# Altium project FMC-320U-A2.PrjPcb
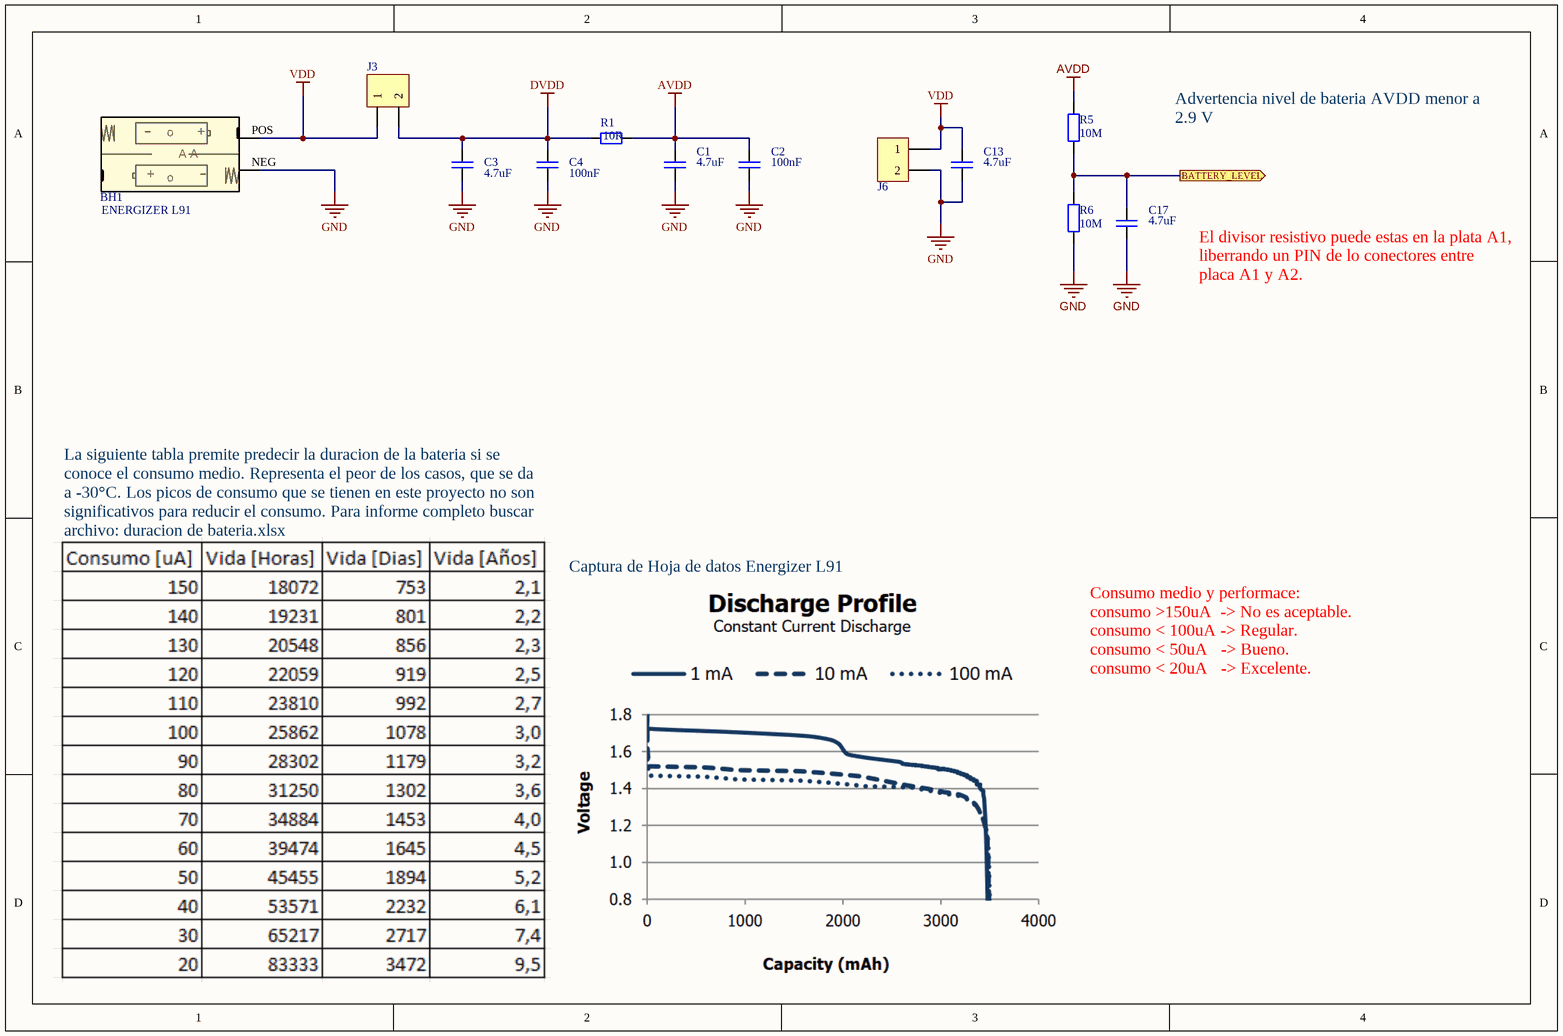
[diagram p0: BATTERY.SchDoc]
5 sheets, 67 parts. Net scope: flat (ports and power ports of the same name join across sheets).
Board file: FMC-320U-A2.PcbDoc
Sheets:
  BATTERY.SchDoc
  CON2.SchDoc
  DIO.SchDoc
  PULSE.SchDoc
  SENSOR.SchDoc

## Sheet BATTERY.SchDoc
size A4

### Parts
BH1  ENERGIZER L91  [BATTERY_HOLDER_2XAA]
C1  4.7uF  [CAP_SM0805_YAGEOCC2_N]
C2  100nF  [CAP_SM0805_YAGEOCC2_N]
C3  4.7uF  [CAP_SM0805_YAGEOCC2_N]
C4  100nF  [CAP_SM0805_YAGEOCC2_N]
C13  4.7uF  [CAP_SM0805_YAGEOCC2_N]
C17  4.7uF  [CAP_SM0805_YAGEOCC2_N]
J3  Usar Equivalente  [HEADER PIN 1X2]  (value not drawn)
J6  Usar Equivalente  [HEADER PIN 1X2]  (value not drawn)
R1  10R  [RES_SM0805_YAGEORC_N]
R5  10M  [RES_SM0805_YAGEORC_N]
R6  10M  [RES_SM0805_YAGEORC_N]

### Ports
BATTERY_LEVEL (out)

### Nets
AVDD: C1.1 C2.1 R1.2 R5.2
DVDD: C3.1 C4.1 J3.2 R1.1
GND: BH1.NEG C1.2 C2.2 C3.2 C4.2 C13.2 C17.2 J6.2 R6.1
VDD: BH1.POS C13.1 J3.1 J6.1
BATTERY_LEVEL: C17.1 R5.1 R6.2 ; port BATTERY_LEVEL

### Notes on the sheet
- Advertencia nivel de bateria AVDD menor a 2.9 V
- El divisor resistivo puede estas en la plata A1, liberrando un PIN de lo conectores entre  placa A1 y A2.
- La siguiente tabla premite predecir la duracion de la bateria si se conoce el consumo medio. Representa el peor de los casos, que se da a -30°C. Los picos de consumo que se tienen en este proyecto no son significativos para reducir el consumo. Para informe completo buscar archivo: duracion de bateria.xlsx
- Captura de Hoja de datos Energizer L91
- Consumo medio y performace:
  consumo >150uA  -> No es aceptable.
  consumo < 100uA -> Regular.
  consumo < 50uA   -> Bueno.
  consumo < 20uA   -> Excelente.
- Title:
- Size: A4
- Date:
- FMC-320U MODEL A
- Sheet:
- Time:
- Of:
- Version:
- Revision:
- Release:
- 1
- 0
- FLOWMEET SRL
- File
- (in symbol 2462) +; A A

### Library data of the parts
BH1 = 2462: 2 x AA through hole economic type; Manufacturer: Keystone; Manufacturer Part Number: 2462; Category: Battery holder; Datasheet: https://www.keyelco.com/userAssets/file/M65p28.pdf; Temperature Max: -; Temperature Min: -
C1 C3 C13 C17 = CC0805KRX5R6BB475: CAP 4.7uF SM0805 X5R 10V YAGEO CC2; Tolerance (%): 10; Category: Capacitor; Manufacturer: Yageo; Manufacturer Part Number: CC0805KRX5R6BB475; Package: 0805; Value: 4.7uF; Supplier Part Number 1: 718671; Supplier 1: Farnell; ComponentLink1URL: http://www.yageo.com; ComponentLink1Description: Manufacturer Website; Voltage Rating (Volts): 10; Supplier 2: Digi-Key; Supplier Part Number 2: 311-1374-1-ND; Datasheet: https://datasheet.lcsc.com/lcsc/2304140030_YAGEO-CC0805KRX5R6BB475_C605218.pdf
C2 C4 = CC0805KRX7R8BB104: CAP 100nF SM0805 X7R 25V YAGEO CC2; Tolerance (%): 10; Voltage Rating (Volts): 25; Category: Capacitor; Manufacturer: Yageo; Manufacturer Part Number: CC0805KRX7R8BB104; Package: 0805; Value: 100nF; Supplier Part Number 1: 644249; Supplier 1: Farnell; ComponentLink1URL: http://www.yageo.com; ComponentLink1Description: Manufacturer Website; Supplier 2: Digi-Key; Supplier Part Number 2: 311-1141-1-ND; Datasheet: https://datasheet.lcsc.com/lcsc/2006111832_YAGEO-CC0805KRX7R8BB104_C519981.pdf
J3 J6 = 54101-T0602LF: 1 x 2 - true hole  2.54mm - Pb free; Manufacturer: Amphenol ICC; Equivalente: B-2100S02P-A110; Manufacturer Part Number: 54101-T0602LF; Category: Header pin; Datasheet: https://datasheet.lcsc.com/lcsc/2202082130_Amphenol-ICC-54101-T06-00_C213463.pdf; Temperature Max: 125; Temperature Min: -65
R1 = RC0805FR-0710RL: RES 10R SM0805 YAGEO RC_L; Power (Watts): 0.125; Resistance (Ohms): 10; Tolerance (%): 1; Category: Resistor; Manufacturer: Yageo; Manufacturer Part Number: RC0805FR-0710RL; Package: 0805; Value: 10R; Supplier Part Number 1: 9237240; Supplier 1: Farnell; ComponentLink1Description: Manufacturer Website; ComponentLink1URL: http://www.yageo.com; Supplier 2: Digi-Key; Supplier Part Number 2: 311-10.0CRCT-ND; Datasheet: https://www.yageo.com/upload/media/product/app/datasheet/rchip/pyu-rc_group_51_rohs_l.pdf
R5 R6 = RC0805FR-0710ML: RES 10M SM0805 YAGEO RC_L; Power (Watts): 0.125; Resistance (Ohms): 10000000; Tolerance (%): 1; Category: Resistor; Manufacturer: Yageo; Manufacturer Part Number: RC0805FR-0710ML; Package: 0805; Value: 10M; Supplier Part Number 1: 9238115; Supplier 1: Farnell; ComponentLink1URL: http://www.yageo.com; ComponentLink1Description: Manufacturer Website; Supplier 2: Digi-Key; Supplier Part Number 2: 311-10.0MCRCT-ND

## Sheet CON2.SchDoc
size A4
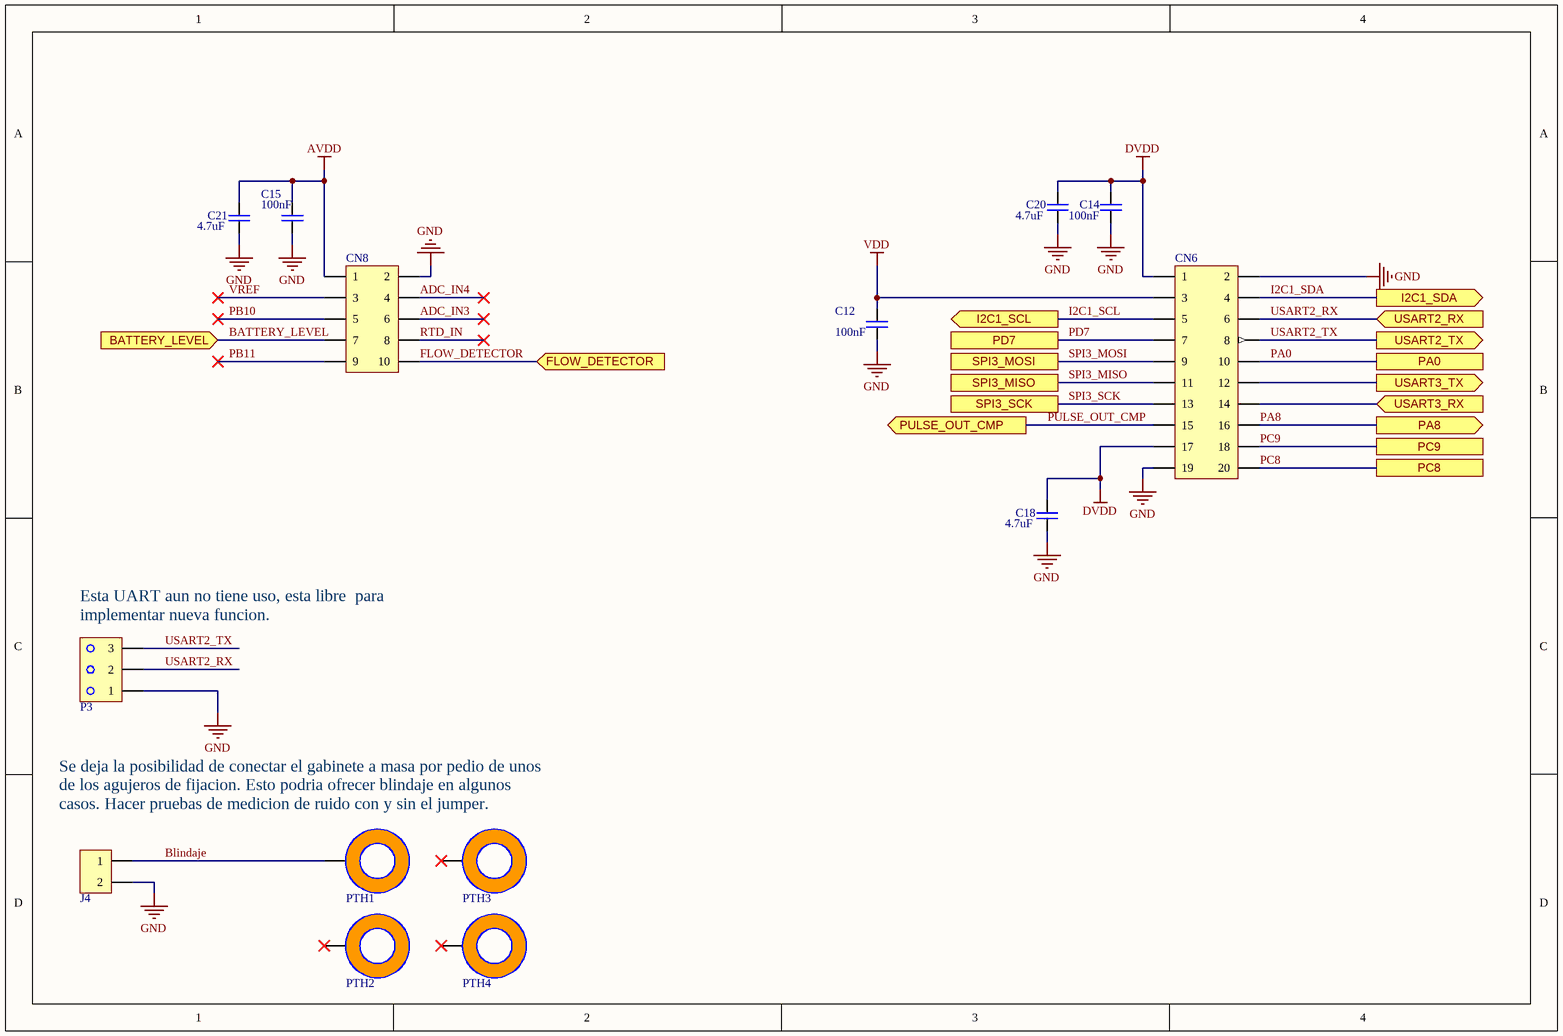
[diagram p1: CON2.SchDoc]

### Parts
C12  100nF  [CAP_SM0805_YAGEOCC2_N]
C14  100nF  [CAP_SM0805_YAGEOCC2_N]
C15  100nF  [CAP_SM0805_YAGEOCC2_N]
C18  4.7uF  [CAP_SM0805_YAGEOCC2_N]
C20  4.7uF  [CAP_SM0805_YAGEOCC2_N]
C21  4.7uF  [CAP_SM0805_YAGEOCC2_N]
CN6  DZ254R-22-20-63  [HEADER PIN 2X10]  (value not drawn)
CN8  Uar Equivalente  [HEADER PIN 2X5 MIRROR]  (value not drawn)
J4  Usar Equivalente  [HEADER PIN 1X2]  (value not drawn)
P3  WJ15EDGVC-3.81-3P  [HEADER PLUG 3]  (value not drawn)
PTH1  PTH-3MM-M  [PTH_M3_M]  (value not drawn)  (no BOM)
PTH2  PTH-3MM-M  [PTH_M3_M]  (value not drawn)  (no BOM)
PTH3  PTH-3MM-M  [PTH_M3_M]  (value not drawn)  (no BOM)
PTH4  PTH-3MM-M  [PTH_M3_M]  (value not drawn)  (no BOM)

### Ports
BATTERY_LEVEL (in), FLOW_DETECTOR (in), I2C1_SCL (out), I2C1_SDA (out), PA0, PA8 (out), PC8, PC9, PD7, PULSE_OUT_CMP (out), SPI3_MISO, SPI3_MOSI, SPI3_SCK, USART2_RX (in), USART2_TX (out), USART3_RX (in), USART3_TX (out)

### Nets
AVDD: C15.1 C21.1 CN8.1
DVDD: C14.1 C18.1 C20.1 CN6.1 CN6.17
GND: C12.2 C14.2 C15.2 C18.2 C20.2 C21.2 CN6.2 CN6.19 CN8.2 J4.2 P3.1
VDD: C12.1 CN6.3
ADC_IN3: CN8.6
ADC_IN4: CN8.4
BATTERY_LEVEL: CN8.7 ; port BATTERY_LEVEL
Blindaje: J4.1 PTH1.1
FLOW_DETECTOR: CN8.10 ; port FLOW_DETECTOR
I2C1_SCL: CN6.5 ; port I2C1_SCL
I2C1_SDA: CN6.4 ; port I2C1_SDA
PA0: CN6.10 ; port PA0
PA8: CN6.16 ; port PA8
PB10: CN8.5
PB11: CN8.9
PC8: CN6.20 ; port PC8
PC9: CN6.18 ; port PC9
PD7: CN6.7 ; port PD7
PULSE_OUT_CMP: CN6.15 ; port PULSE_OUT_CMP
RTD_IN: CN8.8
SPI3_MISO: CN6.11 ; port SPI3_MISO
SPI3_MOSI: CN6.9 ; port SPI3_MOSI
SPI3_SCK: CN6.13 ; port SPI3_SCK
USART2_RX: CN6.6 P3.2 ; port USART2_RX
USART2_TX: CN6.8 P3.3 ; port USART2_TX
VREF: CN8.3
NetCN6_12: CN6.12 ; port USART3_TX
NetCN6_14: CN6.14 ; port USART3_RX

Not connected (* = marked no-connect by the designer): PTH2 1*; PTH3 1*; PTH4 1*

### Notes on the sheet
- (near P3) Esta UART aun no tiene uso, esta libre  para implementar nueva funcion.
- Se deja la posibilidad de conectar el gabinete a masa por pedio de unos de los agujeros de fijacion. Esto podria ofrecer blindaje en algunos casos. Hacer pruebas de medicion de ruido con y sin el jumper.

### Library data of the parts
C12 C14 C15 = CC0805KRX7R8BB104: as C2 on sheet BATTERY; Category: Capacitor; Manufacturer: Yageo; Manufacturer Part Number: CC0805KRX7R8BB104; Package: 0805; Value: 100nF; Supplier Part Number 1: 644249; Supplier 1: Farnell; ComponentLink1URL: http://www.yageo.com; ComponentLink1Description: Manufacturer Website; Supplier 2: Digi-Key; Supplier Part Number 2: 311-1141-1-ND; Datasheet: https://datasheet.lcsc.com/lcsc/2006111832_YAGEO-CC0805KRX7R8BB104_C519981.pdf
C18 C20 C21 = CC0805KRX5R6BB475: as C1 on sheet BATTERY; Category: Capacitor; Manufacturer: Yageo; Manufacturer Part Number: CC0805KRX5R6BB475; Package: 0805; Value: 4.7uF; Supplier Part Number 1: 718671; Supplier 1: Farnell; ComponentLink1URL: http://www.yageo.com; ComponentLink1Description: Manufacturer Website; Voltage Rating (Volts): 10; Supplier 2: Digi-Key; Supplier Part Number 2: 311-1374-1-ND; Datasheet: https://datasheet.lcsc.com/lcsc/2304140030_YAGEO-CC0805KRX5R6BB475_C605218.pdf
CN6 = DZ254R-22-20-63: 2 x 10 - true hole 2.54mm; Manufacturer: DEALON; System: Connector; Manufacturer Part Number: DZ254R-22-20-63; Category: Header pin; Datasheet: https://datasheet.lcsc.com/lcsc/2201121730_DEALON-DZ254R-22-20-63_C2935926.pdf; Temperature Max: -; Temperature Min: -; Supplier: LCSC
CN8 = DZ254R-22-10-63: 2 x 5 - true hole 2.54mm; Manufacturer: DEALON; Equivalente: PZ254V-12-10P; System: Connector; Category: Header pin; Datasheet: https://datasheet.lcsc.com/lcsc/2201121730_DEALON-DZ254R-22-10-63_C2935920.pdf; Manufacturer Part Number: DZ254R-22-10-63; Temperature Max: -; Temperature Min: -; Supplier: LCSC
J4 = 54101-T0602LF: as J3 on sheet BATTERY; Manufacturer Part Number: 54101-T0602LF; Category: Header pin; Datasheet: https://datasheet.lcsc.com/lcsc/2202082130_Amphenol-ICC-54101-T06-00_C213463.pdf; Temperature Max: 125; Temperature Min: -65
P3 = WJ15EDGVC-3.81-3P: TERM BLOK FEMALE 1X3 3.81MM; Manufacturer: Ningbo Kangnex Elec; Category: Bornera enchufable; Manufacturer Part Number: WJ15EDGVC-3.81-3P; Datasheet: https://datasheet.lcsc.com/lcsc/1912251632_Ningbo-Kangnex-Elec-WJ15EDGVC-3-81-3P_C8389.pdf; Temperature Max: 105; Temperature Min: -40
PTH1-PTH4 = PTH-3MM-M: Agujero de montaje metalizado roscas M3. Drill de tamaño medio.; Category: Mounting Hole; Temperature Max: -; Temperature Min: -

## Sheet DIO.SchDoc
size A4
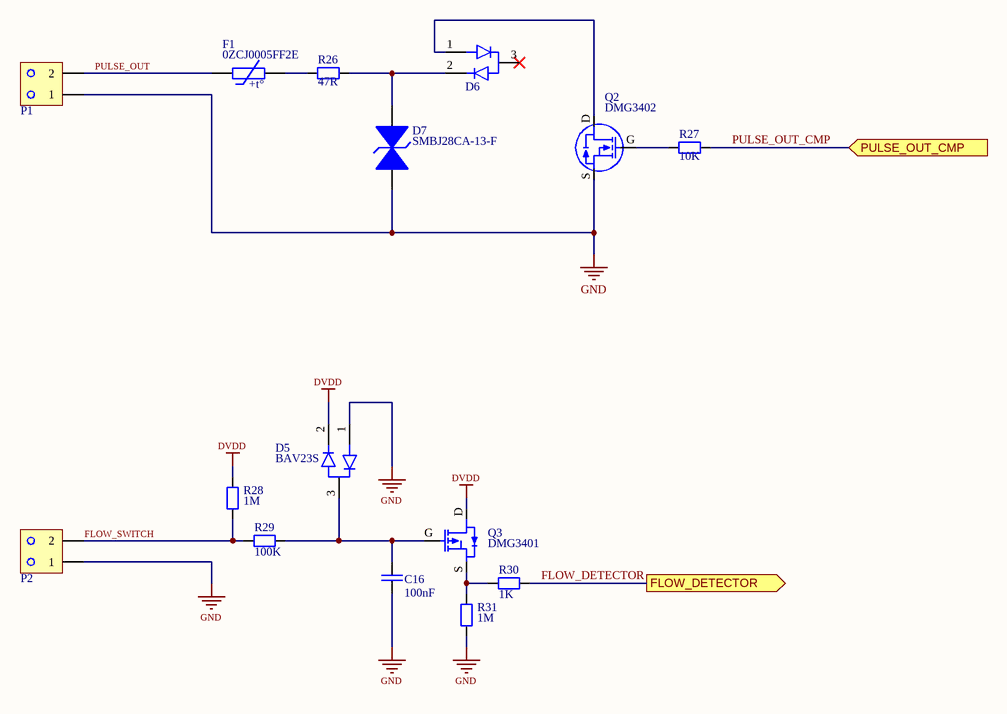
[diagram p2: DIO.SchDoc]

### Parts
C16  100nF  [CAP_SM0805_YAGEOCC2_N]
D5  BAV23S  [BAV23S]
D6  BAV23S  [BAV23S]  (value not drawn)
D7  SMBJ28CA-13-F  [SMBJ28CA-13-F]
F1  0ZCJ0005FF2E  [0ZCJ0005FF2E]
P1  WJ15EDGVC-3.81-2P  [HEADER PLUG 2]  (value not drawn)
P2  WJ15EDGVC-3.81-2P  [HEADER PLUG 2]  (value not drawn)
Q2  DMG3402  [DMG3402L-7]
Q3  DMG3401  [DMG3401LSN-7]
R26  47R  [RES_SM0805_YAGEORC_N]
R27  10K  [RES_SM0805_YAGEORC_N]
R28  1M  [RES_SM0805_YAGEORC_N]
R29  100K  [RES_SM0805_YAGEORC_N]
R30  1K  [RES_SM0805_YAGEORC_N]
R31  1M  [RES_SM0805_YAGEORC_N]

### Ports
FLOW_DETECTOR (out), PULSE_OUT_CMP (in)

### Nets
DVDD: D5.2 Q3.D R28.2
GND: C16.2 D5.1 D7.A P1.1 P2.1 Q2.S R31.1
FLOW_DETECTOR: R30.2 ; port FLOW_DETECTOR
FLOW_SWITCH: P2.2 R28.1 R29.1
PULSE_OUT: F1.1 P1.2
PULSE_OUT_CMP: R27.1 ; port PULSE_OUT_CMP
NetC16_1: C16.1 D5.3 Q3.G R29.2
NetD6_1: D6.1 Q2.D
NetD6_2: D6.2 D7.K R26.1
NetF1_2: F1.2 R26.2
NetQ2_G: Q2.G R27.2
NetQ3_S: Q3.S R30.1 R31.2

Not connected (* = marked no-connect by the designer): D6 3*

### Notes on the sheet
- (in symbol 0ZCJ0005FF2E) +t°

### Library data of the parts
C16 = CC0805KRX7R8BB104: as C2 on sheet BATTERY; Category: Capacitor; Manufacturer: Yageo; Manufacturer Part Number: CC0805KRX7R8BB104; Package: 0805; Value: 100nF; Supplier Part Number 1: 644249; Supplier 1: Farnell; ComponentLink1URL: http://www.yageo.com; ComponentLink1Description: Manufacturer Website; Supplier 2: Digi-Key; Supplier Part Number 2: 311-1141-1-ND; Datasheet: https://datasheet.lcsc.com/lcsc/2006111832_YAGEO-CC0805KRX7R8BB104_C519981.pdf
D5 D6 = BAV23S: DIODE ARRAY GP 250V 200MA SOT23; Manufacturer: onsemi; Manufacturer Part Number: BAV23S; Category: Diodo; Datasheet: https://www.onsemi.com/pdf/datasheet/bav23s-d.pdf; Temperature Max: 150; Temperature Min: -55
D7 = SMBJ28CA-13-F: Manufacturer: Diodes Incorporated; Manufacturer Part Number: SMBJ24CA; Value: 24V - 26.7V - 38.9V; Category: Diodo; Datasheet: https://datasheet.lcsc.com/lcsc/2304140030_Diodes-Incorporated-SMBJ28CA-13-F_C135064.pdf; Temperature Max: 150; Temperature Min: -55
F1 = 0ZCJ0005FF2E: PTC RESET FUSE 60V 50MA 1206; Manufacturer: Bel Fuse Inc.; Manufacturer Part Number: 0ZCJ0005FF2E; Category: Fusible; Datasheet: https://www.belfuse.com/resources/datasheets/circuitprotection/ds-cp-0zcj-series.pdf; Temperature Max: 85; Temperature Min: -40
P1 P2 = WJ15EDGVC-3.81-2P: TERM BLOK FEMALE 1X2 3.81MM; Manufacturer: Ningbo Kangnex Elec; Manufacturer Part Number: WJ15EDGVC-3.81-2P; Category: Bornera enchufable; Datasheet: https://datasheet.lcsc.com/lcsc/1912251633_Ningbo-Kangnex-Elec-WJ15EDGVC-3-81-2P_C8396.pdf; Temperature Max: 105; Temperature Min: -40
Q2 = DMG3402L-7: N-CHANNEL ENHANCEMENT MODE FIELD EFFECT TRANSISTOR / 85mΩ @ VGS = 2.5V -> ID 2A / V(BR)DDS 30V; Manufacturer: Diodes Incorporated; Category: Transistor mosfet; Manufacturer Part Number: DMG3402L-7; Datasheet: https://www.diodes.com/assets/Datasheets/DMG3402L.pdf; Temperature Max: 150; Temperature Min: -55
Q3 = DMG3401LSN-7: P-CHANNEL ENHANCEMENT MODE MOSFET / RDS(ON) = 85mΩ @ VGS = -2.5V -> ID -2.7A / V(BR)DDS 30V; Manufacturer: Diodes Incorporated; Category: Transistor mosfet; Manufacturer Part Number: DMG3401LSN-7; Datasheet: https://www.diodes.com/assets/Datasheets/DMG3401LSN.pdf; Temperature Max: 150; Temperature Min: -55
R26 = RC0805FR-0747RL: RES 47R SM0805 YAGEO RC_L; Power (Watts): 0.125; Resistance (Ohms): 47; Tolerance (%): 1; Category: Resistor; Manufacturer: Yageo; Manufacturer Part Number: RC0805FR-0747RL; Package: 0805; Value: 47R; Supplier Part Number 1: 9237321; Supplier 1: Farnell; ComponentLink1Description: Manufacturer Website; ComponentLink1URL: http://www.yageo.com; Supplier 2: Digi-Key; Supplier Part Number 2: 311-47.0CRCT-ND; Datasheet: https://www.yageo.com/upload/media/product/app/datasheet/rchip/pyu-rc_group_51_rohs_l.pdf
R27 = RC0805FR-0710KL: RES 10K SM0805 YAGEO RC_L; Power (Watts): 0.125; Resistance (Ohms): 10000; Tolerance (%): 1; Category: Resistor; Manufacturer: Yageo; Manufacturer Part Number: RC0805FR-0710KL; Package: 0805; Value: 10K; Supplier Part Number 1: 9237755; Supplier 1: Farnell; ComponentLink1Description: Manufacturer Website; ComponentLink1URL: http://www.yageo.com; Supplier 2: Digi-Key; Supplier Part Number 2: 311-10.0KCRCT-ND; Datasheet: https://www.yageo.com/upload/media/product/app/datasheet/rchip/pyu-rc_group_51_rohs_l.pdf
R28 R31 = RC0805FR-071ML: RES 1M SM0805 YAGEO RC_L; Power (Watts): 0.125; Resistance (Ohms): 1000000; Tolerance (%): 1; Category: Resistor; Manufacturer: Yageo; Manufacturer Part Number: RC0805FR-071ML; Package: 0805; Value: 1M; Supplier Part Number 1: 9237992; Supplier 1: Farnell; ComponentLink1URL: http://www.yageo.com; ComponentLink1Description: Manufacturer Website; Supplier 2: Digi-Key; Supplier Part Number 2: 311-1.00MCRCT-ND; Datasheet: https://www.yageo.com/upload/media/product/productsearch/datasheet/rchip/PYu-RC_Group_51_RoHS_L_12.pdf
R29 = RC0805FR-07100KL: RES 100K SM0805 YAGEO RC_L; Power (Watts): 0.125; Resistance (Ohms): 100000; Tolerance (%): 1; Category: Resistor; Manufacturer: Yageo; Manufacturer Part Number: RC0805FR-07100KL; Package: 0805; Value: 100K; Supplier Part Number 1: 9237879; Supplier 1: Farnell; ComponentLink1Description: Manufacturer Website; ComponentLink1URL: http://www.yageo.com; Supplier 2: Digi-Key; Supplier Part Number 2: 311-100KCRCT-ND; Datasheet: https://www.yageo.com/upload/media/product/app/datasheet/rchip/pyu-rc_group_51_rohs_l.pdf
R30 = RC0805FR-071KL: RES 1K SM0805 YAGEO RC_L; Power (Watts): 0.125; Resistance (Ohms): 1000; Tolerance (%): 1; Category: Resistor; Manufacturer: Yageo; Manufacturer Part Number: RC0805FR-071KL; Package: 0805; Value: 1K; Supplier Part Number 1: 9237496; Supplier 1: Farnell; ComponentLink1URL: http://www.yageo.com; ComponentLink1Description: Manufacturer Website; Supplier 2: Digi-Key; Supplier Part Number 2: 311-1.00KCRCT-ND; Datasheet: https://www.yageo.com/upload/media/product/app/datasheet/rchip/pyu-rc_group_51_rohs_l.pdf

## Sheet PULSE.SchDoc
size A4
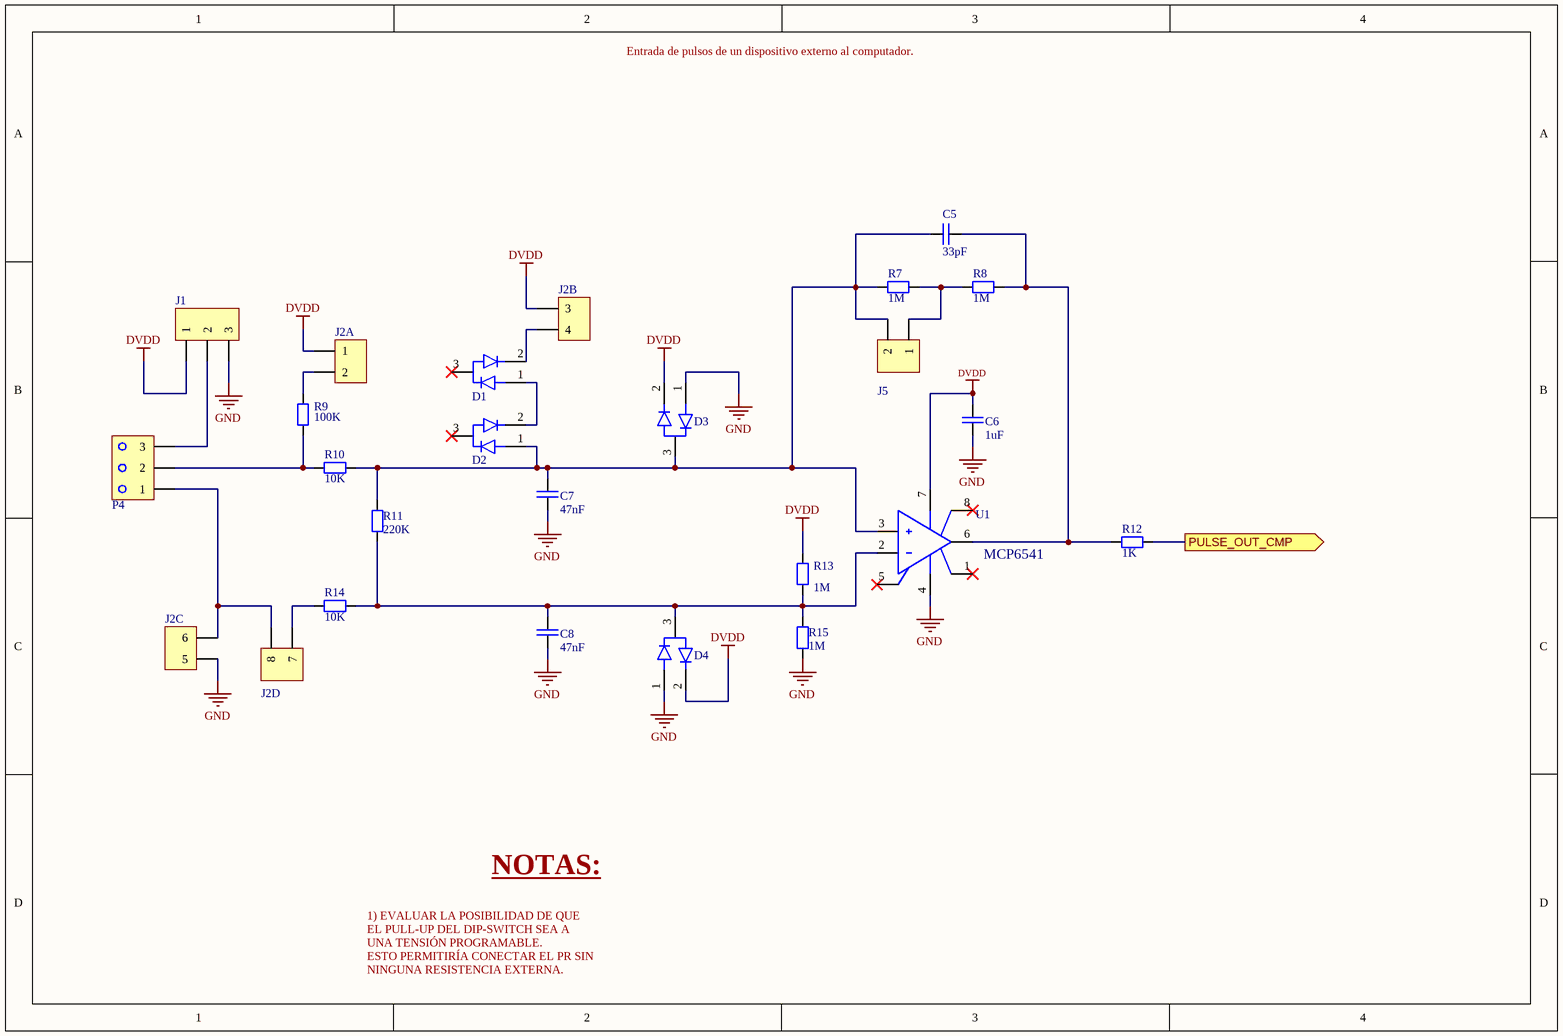
[diagram p3: PULSE.SchDoc]

### Parts
C5  33pF  [CAP_SM0805_YAGEOCC2_N]
C6  1uF  [CAP_SM0805_YAGEOCC2_N]
C7  47nF  [CAP_SM0805_YAGEOCC2_N]
C8  47nF  [CAP_SM0805_YAGEOCC2_N]
D1  BAV23S  [BAV23S]  (value not drawn)
D2  BAV23S  [BAV23S]  (value not drawn)
D3  BAV23S  [BAV23S]  (value not drawn)
D4  BAV23S  [BAV23S]  (value not drawn)
J1  (no value)  [HEADER PIN 1X3]
J2  Usar equivalente  [HEADER PIN 2X4]  (value not drawn)  (parts A,B,C,D of 4)
J5  Usar Equivalente  [HEADER PIN 1X2]  (value not drawn)
P4  WJ15EDGVC-3.81-3P  [HEADER PLUG 3]  (value not drawn)
R7  1M  [RES_SM0805_YAGEORC_N]
R8  1M  [RES_SM0805_YAGEORC_N]
R9  100K  [RES_SM0805_YAGEORC_N]
R10  10K  [RES_SM0805_YAGEORC_N]
R11  220K  [RES_SM0805_YAGEORC_N]
R12  1K  [RES_SM0805_YAGEORC_N]
R13  1M  [RES_SM0805_YAGEORC_N]
R14  10K  [RES_SM0805_YAGEORC_N]
R15  1M  [RES_SM0805_YAGEORC_N]
U1  MCP6541  [MCP6541-E/SN]

### Ports
PULSE_OUT_CMP (out)

### Nets
DVDD: C6.1 D3.2 D4.2 J1.1 J2.1 J2.3 R13.2 U1.7(V+)
GND: C6.2 C7.2 C8.2 D3.1 D4.1 J1.3 J2.5 R15.1 U1.4(V-)
PULSE_OUT_CMP: R12.2 ; port PULSE_OUT_CMP
NetC5_1: C5.1 C7.1 D2.1 D3.3 J5.2 R7.1 R10.2 R11.2 U1.3(IN+)
NetC5_2: C5.2 R8.2 R12.1 U1.6(OUT)
NetC8_1: C8.1 D4.3 R11.1 R13.1 R14.2 R15.2 U1.2(IN-)
NetD1_1: D1.1 D2.2
NetD1_2: D1.2 J2.4
NetJ1_2: J1.2 P4.3
NetJ2_2: J2.2 R9.2
NetJ2_6: J2.6 J2.8 P4.1
NetJ2_7: J2.7 R14.1
NetJ5_1: J5.1 R7.2 R8.1
NetP4_2: P4.2 R9.1 R10.1

Not connected (* = marked no-connect by the designer): D1 3*; D2 3*; U1 1(OS_NUL)* 5(OS_NUL)* 8(TAB)*

### Notes on the sheet
- Entrada de pulsos de un dispositivo externo al computador.
- NOTAS:
- 1) EVALUAR LA POSIBILIDAD DE QUE EL PULL-UP DEL DIP-SWITCH SEA A UNA TENSIÓN PROGRAMABLE.
  ESTO PERMITIRÍA CONECTAR EL PR SIN NINGUNA RESISTENCIA EXTERNA.
- Title:
- Size: A4
- Date:
- FMC-320U MODEL A
- Sheet:
- Time:
- Of:
- Version:
- Revision:
- Release:
- 1
- 0
- FLOWMEET SRL
- File

### Library data of the parts
C5 = CC0805JRNPO9BN330: CAP 33pF SM0805 NPO 50V YAGEO CC2; Tolerance (%): 5; Voltage Rating (Volts): 50; Category: Capacitor; Manufacturer: Yageo; Manufacturer Part Number: CC0805JRNPO9BN330; Package: 0805; Value: 33pF; Supplier Part Number 1: 1362559; Supplier 1: Farnell; ComponentLink1URL: http://www.yageo.com; ComponentLink1Description: Manufacturer Website; Supplier 2: Digi-Key; Supplier Part Number 2: 311-1105-1-ND; Datasheet: https://datasheet.lcsc.com/lcsc/2304140030_YAGEO-CC0805JRNPO9BN330_C107115.pdf
C6 = CC0805KKX7R8BB105: CAP 1uF SM0805 X7R 25V YAGEO CC2; Tolerance (%): 10; Voltage Rating (Volts): 25; Category: Capacitor; Manufacturer: Yageo; Manufacturer Part Number: CC0805KKX7R8BB105; Package: 0805; Value: 1uF; Supplier Part Number 1: 1458903; Supplier 1: Farnell; ComponentLink1URL: http://www.yageo.com; ComponentLink1Description: Manufacturer Website; Supplier 2: Digi-Key; Supplier Part Number 2: 311-1456-1-ND; Datasheet: https://datasheet.lcsc.com/lcsc/2304140030_YAGEO-CC0805KKX7R8BB105_C91186.pdf
C7 C8 = CC0805KRX7R8BB473: CAP 47nF SM0805 X7R 25V YAGEO CC2; Tolerance (%): 10; Voltage Rating (Volts): 25; Category: Capacitor; Manufacturer: Yageo; Manufacturer Part Number: CC0805KRX7R8BB473; Package: 0805; Value: 47nF; Supplier Part Number 1: 644201; Supplier 1: Farnell; ComponentLink1URL: http://www.yageo.com; ComponentLink1Description: Manufacturer Website; Supplier 2: Digi-Key; Datasheet: https://datasheet.lcsc.com/lcsc/2304140030_YAGEO-CC0805KRX7R8BB473_C309492.pdf
D1-D4 = BAV23S: as D5 on sheet DIO; Manufacturer Part Number: BAV23S; Category: Diodo; Datasheet: https://www.onsemi.com/pdf/datasheet/bav23s-d.pdf; Temperature Max: 150; Temperature Min: -55
J1 = 54101-T0600LF-03: 1 x 3 - Cuttable - true hole  2.54mm - Pb free; Manufacturer: Amphenol ICC; Manufacturer Part Number: 54101-T06-00; Type: Thru-hole; Package: 2.54mm; ComponentLink1Description: Datasheet; ComponentLink1URL: https://datasheet.lcsc.com/lcsc/2202082130_Amphenol-ICC-54101-T06-00_C213463.pdf
J2 = 54102-T0604LF-JUMPER: 2 x 4  - true hole  2.54mm; Manufacturer: Amphenol ICC; Equivalente: PZ254V-12-8P; Category: Header pin; Datasheet: https://cdn.amphenol-cs.com/media/wysiwyg/files/drawing/54102.pdf; Manufacturer Part Number: 54102-T0604LF; Temperature Max: 125; Temperature Min: -65
J5 = 54101-T0602LF: as J3 on sheet BATTERY; Manufacturer Part Number: 54101-T0602LF; Category: Header pin; Datasheet: https://datasheet.lcsc.com/lcsc/2202082130_Amphenol-ICC-54101-T06-00_C213463.pdf; Temperature Max: 125; Temperature Min: -65
P4 = WJ15EDGVC-3.81-3P: as P3 on sheet CON2; Category: Bornera enchufable; Manufacturer Part Number: WJ15EDGVC-3.81-3P; Datasheet: https://datasheet.lcsc.com/lcsc/1912251632_Ningbo-Kangnex-Elec-WJ15EDGVC-3-81-3P_C8389.pdf; Temperature Max: 105; Temperature Min: -40
R7 R8 R13 R15 = RC0805FR-071ML: as R28 on sheet DIO; Category: Resistor; Manufacturer: Yageo; Manufacturer Part Number: RC0805FR-071ML; Package: 0805; Value: 1M; Supplier Part Number 1: 9237992; Supplier 1: Farnell; ComponentLink1URL: http://www.yageo.com; ComponentLink1Description: Manufacturer Website; Supplier 2: Digi-Key; Supplier Part Number 2: 311-1.00MCRCT-ND; Datasheet: https://www.yageo.com/upload/media/product/productsearch/datasheet/rchip/PYu-RC_Group_51_RoHS_L_12.pdf
R9 = RC0805FR-07100KL: as R29 on sheet DIO; Category: Resistor; Manufacturer: Yageo; Manufacturer Part Number: RC0805FR-07100KL; Package: 0805; Value: 100K; Supplier Part Number 1: 9237879; Supplier 1: Farnell; ComponentLink1Description: Manufacturer Website; ComponentLink1URL: http://www.yageo.com; Supplier 2: Digi-Key; Supplier Part Number 2: 311-100KCRCT-ND; Datasheet: https://www.yageo.com/upload/media/product/app/datasheet/rchip/pyu-rc_group_51_rohs_l.pdf
R10 R14 = RC0805FR-0710KL: as R27 on sheet DIO; Category: Resistor; Manufacturer: Yageo; Manufacturer Part Number: RC0805FR-0710KL; Package: 0805; Value: 10K; Supplier Part Number 1: 9237755; Supplier 1: Farnell; ComponentLink1Description: Manufacturer Website; ComponentLink1URL: http://www.yageo.com; Supplier 2: Digi-Key; Supplier Part Number 2: 311-10.0KCRCT-ND; Datasheet: https://www.yageo.com/upload/media/product/app/datasheet/rchip/pyu-rc_group_51_rohs_l.pdf
R11 = RC0805FR-07220KL: RES 220K SM0805 YAGEO RC_L; Power (Watts): 0.125; Resistance (Ohms): 220000; Tolerance (%): 1; Category: Resistor; Manufacturer: Yageo; Manufacturer Part Number: RC0805FR-07220KL; Package: 0805; Value: 220K; Supplier Part Number 1: 9237917; Supplier 1: Farnell; ComponentLink1Description: Manufacturer Website; ComponentLink1URL: http://www.yageo.com; Supplier 2: Digi-Key; Supplier Part Number 2: 311-220KCRCT-ND; Datasheet: https://www.yageo.com/upload/media/product/productsearch/datasheet/rchip/PYu-RC_Group_51_RoHS_L_12.pdf
R12 = RC0805FR-071KL: as R30 on sheet DIO; Category: Resistor; Manufacturer: Yageo; Manufacturer Part Number: RC0805FR-071KL; Package: 0805; Value: 1K; Supplier Part Number 1: 9237496; Supplier 1: Farnell; ComponentLink1URL: http://www.yageo.com; ComponentLink1Description: Manufacturer Website; Supplier 2: Digi-Key; Supplier Part Number 2: 311-1.00KCRCT-ND; Datasheet: https://www.yageo.com/upload/media/product/app/datasheet/rchip/pyu-rc_group_51_rohs_l.pdf
U1 = MCP6541-E/SN: IC COMP PP I/O SNGL 1.6V 8SOIC; Manufacturer: Microchip Tech; Manufacturer Part Number: MCP6541-E/SN; Category: Amplificador operacional; Datasheet: https://ww1.microchip.com/downloads/en/DeviceDoc/MCP6541%20Output%20SubMicroamp%20Comparators%2020001696K.pdf; Temperature Max: 85; Temperature Min: -40

## Sheet SENSOR.SchDoc
size A4
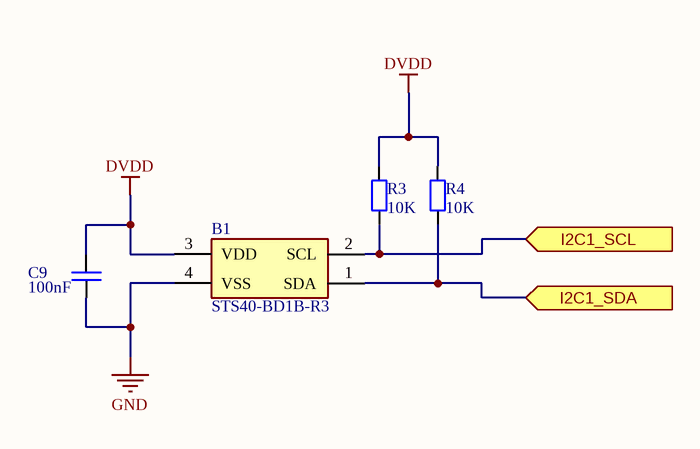
[diagram p4: SENSOR.SchDoc]

### Parts
B1  STS40-BD1B-R3  [STS40BD1BR3]
C9  100nF  [CAP_SM0805_YAGEOCC2_N]
R3  10K  [RES_SM0805_YAGEORC_N]
R4  10K  [RES_SM0805_YAGEORC_N]

### Ports
I2C1_SCL (in), I2C1_SDA (in)

### Nets
DVDD: B1.3(VDD) C9.2 R3.2 R4.2
GND: B1.4(VSS) C9.1
I2C1_SCL: B1.2(SCL) R3.1 ; port I2C1_SCL
I2C1_SDA: B1.1(SDA) R4.1 ; port I2C1_SDA

### Notes on the sheet
- Title:
- Size: A4
- Date:
- FMC-320U MODEL A
- Sheet:
- Time:
- Of:
- Version:
- Revision:
- Release:
- 1
- 0
- FLOWMEET SRL
- File

### Library data of the parts
B1 = STS40-BD1B-R3: Board Mount Temperature Sensors Base Accuracy Version, I2C Address 0x45; Manufacturer_Name: Sensirion; Geometry.Height: 0.65mm; Arrow Part Number: STS40-BD1B-R3; Arrow Price/Stock: https://www.arrow.com/en/products/sts40-bd1b-r3/sensirion-ag?region=nac; Datasheet Link: https://sensirion.com/media/documents/D2D0B4A9/62CBE395/Sensirion_Datasheet_STS4x.pdf; Manufacturer_Part_Number: STS40-BD1B-R3
C9 = CC0805KRX7R8BB104: as C2 on sheet BATTERY; Category: Capacitor; Manufacturer: Yageo; Manufacturer Part Number: CC0805KRX7R8BB104; Package: 0805; Value: 100nF; Supplier Part Number 1: 644249; Supplier 1: Farnell; ComponentLink1URL: http://www.yageo.com; ComponentLink1Description: Manufacturer Website; Supplier 2: Digi-Key; Supplier Part Number 2: 311-1141-1-ND; Datasheet: https://datasheet.lcsc.com/lcsc/2006111832_YAGEO-CC0805KRX7R8BB104_C519981.pdf
R3 R4 = RC0805FR-0710KL: as R27 on sheet DIO; Category: Resistor; Manufacturer: Yageo; Manufacturer Part Number: RC0805FR-0710KL; Package: 0805; Value: 10K; Supplier Part Number 1: 9237755; Supplier 1: Farnell; ComponentLink1Description: Manufacturer Website; ComponentLink1URL: http://www.yageo.com; Supplier 2: Digi-Key; Supplier Part Number 2: 311-10.0KCRCT-ND; Datasheet: https://www.yageo.com/upload/media/product/app/datasheet/rchip/pyu-rc_group_51_rohs_l.pdf

## Nets that join several sheets
AVDD: BATTERY (C1.1 C2.1 R1.2 R5.2), CON2 (C15.1 C21.1 CN8.1)
DVDD: BATTERY (C3.1 C4.1 J3.2 R1.1), CON2 (5 pins), DIO (D5.2 Q3.D R28.2), PULSE (8 pins), SENSOR (B1.3 C9.2 R3.2 R4.2)
GND: BATTERY (9 pins), CON2 (11 pins), DIO (7 pins), PULSE (9 pins), SENSOR (B1.4 C9.1)
VDD: BATTERY (BH1.POS C13.1 J3.1 J6.1), CON2 (C12.1 CN6.3)
BATTERY_LEVEL: BATTERY (C17.1 R5.1 R6.2), CON2 (CN8.7)
FLOW_DETECTOR: CON2 (CN8.10), DIO (R30.2)
I2C1_SCL: CON2 (CN6.5), SENSOR (B1.2 R3.1)
I2C1_SDA: CON2 (CN6.4), SENSOR (B1.1 R4.1)
PULSE_OUT_CMP: CON2 (CN6.15), DIO (R27.1), PULSE (R12.2)